# EAGLE design lmx2572_single_ended (EAGLE 9.5.2)
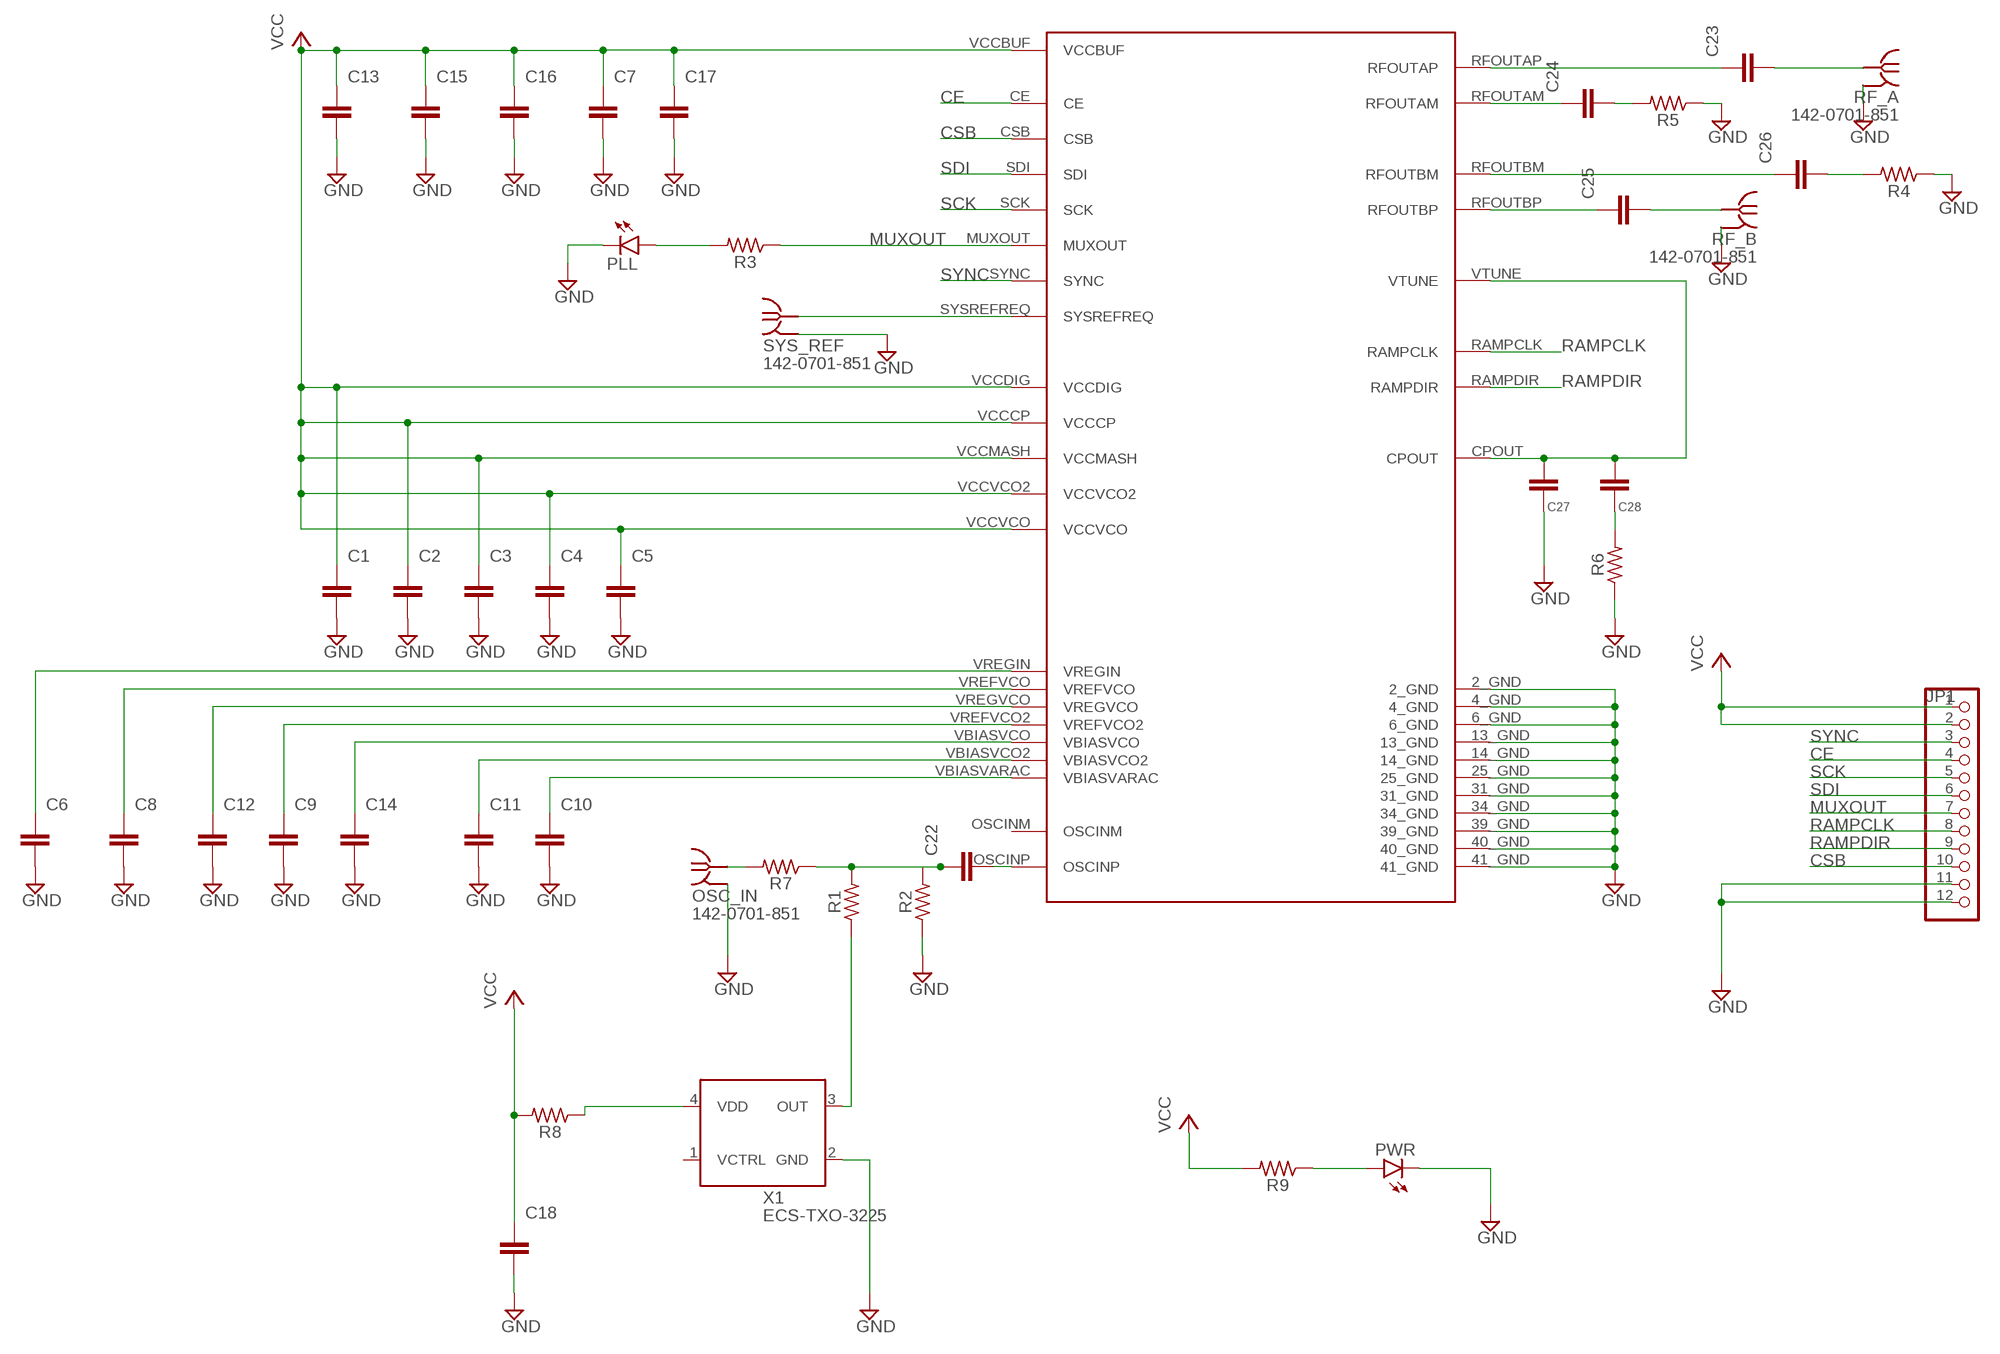
[diagram p0: schematic, sheet 1]

## Parts
C1  1.0uF  C-EU0603-B-NOSILK  [.0603-B-NOSILK]
C2  1.0uF  C-EU0603-B-NOSILK  [.0603-B-NOSILK]
C3  1.0uF  C-EU0603-B-NOSILK  [.0603-B-NOSILK]
C4  1.0uF  C-EU0603-B-NOSILK  [.0603-B-NOSILK]
C5  1.0uF  C-EU0603-B-NOSILK  [.0603-B-NOSILK]
C6  1.0uF  C-EU0603-B-NOSILK  [.0603-B-NOSILK]
C7  0.1uF  C-EU0603-B-NOSILK  [.0603-B-NOSILK]
C8  10uF  C-EU0603-B-NOSILK  [.0603-B-NOSILK]
C9  10uF  C-EU0603-B-NOSILK  [.0603-B-NOSILK]
C10  10uF  C-EU0603-B-NOSILK  [.0603-B-NOSILK]
C11  0.1uF  C-EU0603-B-NOSILK  [.0603-B-NOSILK]
C12  10nF  C-EU0603-B-NOSILK  [.0603-B-NOSILK]
C13  0.1uF  C-EU0603-B-NOSILK  [.0603-B-NOSILK]
C14  470pF  C-EU0603-B-NOSILK  [.0603-B-NOSILK]
C15  10uF  C-EU0603-B-NOSILK  [.0603-B-NOSILK]
C16  10uF  C-EU0603-B-NOSILK  [.0603-B-NOSILK]
C17  0.1uF  C-EU0603-B-NOSILK  [.0603-B-NOSILK]
C18  10uF  C-EU0603-B-NOSILK  [.0603-B-NOSILK]
C22  0.1uF  C-EU0402-C-NOSILK  [.0402-C-NOSILK]
C23  100PF  C-EU0402-C-NOSILK  [.0402-C-NOSILK]
C24  100PF  C-EU0402-C-NOSILK  [.0402-C-NOSILK]
C25  100PF  C-EU0402-C-NOSILK  [.0402-C-NOSILK]
C26  100PF  C-EU0402-C-NOSILK  [.0402-C-NOSILK]
C27  4.7nf  C-EU0402-C-NOSILK  [.0402-C-NOSILK]
C28  220nf  C-EU0402-C-NOSILK  [.0402-C-NOSILK]
JP1  PINHD-1X12  [1X12]
OSC_IN  142-0701-851  [142-0701-851]
PLL  LEDCHIP-LED0603  [CHIP-LED0603]
PWR  LEDCHIP-LED0603  [CHIP-LED0603]
R1  0  R-US_0402-C-NOSILK  [.0402-C-NOSILK]
R2  50  R-US_0402-C-NOSILK  [.0402-C-NOSILK]
R3  330  R-US_0603-B-NOSILK  [.0603-B-NOSILK]
R4  50  R-US_0402-C-NOSILK  [.0402-C-NOSILK]
R5  50  R-US_0402-C-NOSILK  [.0402-C-NOSILK]
R6  100  R-US_0402-C-NOSILK  [.0402-C-NOSILK]
R7  0  R-US_0402-C-NOSILK  [.0402-C-NOSILK]
R8  0  R-US_0402-C-NOSILK  [.0402-C-NOSILK]
R9  330  R-US_0603-B-NOSILK  [.0603-B-NOSILK]
RF_A  142-0701-851  [142-0701-851]
RF_B  142-0701-851  [142-0701-851]
SYS_REF  142-0701-851  [142-0701-851]
U$1  LMX2572_QFN  [LMX2572_QFN]
X1  ECS-TXO-3225  [3.2X2.5]

## Nets
CE: JP1.4 U$1.CE
CSB: JP1.10 U$1.CSB
GND: C1.2 C2.2 C3.2 C4.2 C5.2 C6.2 C7.2 C8.2 C9.2 C10.2 C11.2 C12.2 C13.2 C14.2 C15.2 C16.2 C17.2 C18.2 C27.1 JP1.11 JP1.12 OSC_IN.GND1(GND) OSC_IN.GND2(GND) OSC_IN.GND3(GND) OSC_IN.GND4(GND) PLL.C PWR.C R2.1 R4.1 R5.1 R6.1 RF_A.GND1(GND) RF_A.GND2(GND) RF_A.GND3(GND) RF_A.GND4(GND) RF_B.GND1(GND) RF_B.GND2(GND) RF_B.GND3(GND) RF_B.GND4(GND) SYS_REF.GND1(GND) SYS_REF.GND2(GND) SYS_REF.GND3(GND) SYS_REF.GND4(GND) U$1.2_GND U$1.4_GND U$1.6_GND U$1.13_GND U$1.14_GND U$1.25_GND U$1.31_GND U$1.34_GND U$1.39_GND U$1.40_GND U$1.41_GND X1.2(GND)
MUXOUT: JP1.7 R3.1 U$1.MUXOUT
N$1: C10.1 U$1.VBIASVARAC
N$2: C11.1 U$1.VBIASVCO2
N$3: C14.1 U$1.VBIASVCO
N$4: C9.1 U$1.VREFVCO2
N$5: C12.1 U$1.VREGVCO
N$6: C8.1 U$1.VREFVCO
N$7: C6.1 U$1.VREGIN
N$8: C22.2 U$1.OSCINP
N$9 [RF]: R1.1 X1.3(OUT)
N$10: R8.1 X1.4(VDD)
N$11 [RF]: OSC_IN.RF1(RF) R7.2
N$12: C28.1 R6.2
N$13 [RF]: SYS_REF.RF1(RF) U$1.SYSREFREQ
N$14: PLL.A R3.2
N$15: C26.1 U$1.RFOUTBM
N$16 [RF]: C23.1 U$1.RFOUTAP
N$17 [RF]: C23.2 RF_A.RF1(RF)
N$18 [RF]: C25.2 RF_B.RF1(RF)
N$19 [RF]: C25.1 U$1.RFOUTBP
N$20 [RF]: C24.1 U$1.RFOUTAM
N$21 [RF]: C22.1 R1.2 R2.2 R7.1
N$22 [RF]: C26.2 R4.2
N$23 [RF]: C24.2 R5.2
N$24: C27.2 C28.2 U$1.CPOUT U$1.VTUNE
N$25: PWR.A R9.1
RAMPCLK: JP1.8 U$1.RAMPCLK
RAMPDIR: JP1.9 U$1.RAMPDIR
SCK: JP1.5 U$1.SCK
SDI: JP1.6 U$1.SDI
SYNC: JP1.3 U$1.SYNC
VCC [Power]: C1.1 C2.1 C3.1 C4.1 C5.1 C7.1 C13.1 C15.1 C16.1 C17.1 C18.1 JP1.1 JP1.2 R8.2 R9.2 U$1.VCCBUF U$1.VCCCP U$1.VCCDIG U$1.VCCMASH U$1.VCCVCO U$1.VCCVCO2
Unconnected: U$1.OSCINM X1.1(VCTRL)

## Library data of the parts
C1-C18 C22-C28 = oresat-rcl:C-EU: CAPACITOR, European symbol
JP1 = pinhead:PINHD-1X12: PIN HEADER
OSC_IN RF_A RF_B SYS_REF = J-Cinch-142-0701-851-SMA-end-launch:142-0701-851: SMA Jack 50Ω - End Launch Source: Datasheet <https://belfuse.com/resources/productinformations/cinchconnectivitysolutions/johnson/pi-ccs-john-142-0701-851.pdf>
PLL PWR = led:LED: LED OSRAM: - CHIPLED LG R971, LG N971, LY N971, LG Q971, LY Q971, LO R971, LY R971 LH N974, LH R974 LS Q976, LO Q976, LY Q976 LO Q996 - Hyper CHIPLED LW Q18S LB Q993, LB Q99A, LB R99A - SideLED LS A670, LO A670, LY A670, LG A670, LP A670 LB A673, LV A673, LT A673, LW A673 LH A674 LY A675 LS A676, LA A676, LO A676, LY A676, LW A676 LS A679, LY A679, LG A679 - Hyper Micro SIDELED® LS Y876, LA Y876, LO Y876, LY Y876 LT Y87S - SmartLED LW L88C, LW L88S LB L89C, LB L89S, LG L890 LS L89K, LO L89K, LY L89K LS L896, LA L896, LO L896, LY L896 - TOPLED LS T670, LO T670, LY T670, LG T670, LP T670 LSG T670, LSP T670, LSY T670, LOP T670, LYG T670 LG T671, LOG T671, LSG T671 LB T673, LV T673, LT T673, LW T673 LH T674 LS T676, LA T676, LO T676, LY T676, LB T676, LH T676, LSB T676, LW T676 LB T67C, LV T67C, LT T67C, LS T67K, LO T67K, LY T67K, LW E67C LS E67B, LA E67B, LO E67B, LY E67B, LB E67C, LV E67C, LT E67C LW T67C LS T679, LY T679, LG T679 LS T770, LO T770, LY T770, LG T770, LP T770 LB T773, LV T773, LT T773, LW T773 LH T774 LS E675, LA E675, LY E675, LS T675 LS T776, LA T776, LO T776, LY T776, LB T776 LHGB T686 LT T68C, LB T68C - Hyper Mini TOPLED® LB M676 - Mini TOPLED Santana® LG M470 LS M47K, LO M47K, LY M47K Source: http://www.osram.convergy.de LUXEON: - LUMILED® LXK2-PW12-R00, LXK2-PW12-S00, LXK2-PW14-U00, LXK2-PW14-V00 LXK2-PM12-R00, LXK2-PM12-S00, LXK2-PM14-U00 LXK2-PE12-Q00, LXK2-PE12-R00, LXK2-PE12-S00, LXK2-PE14-T00, LXK2-PE14-U00 LXK2-PB12-K00, LXK2-PB12-L00, LXK2-PB12-M00, LXK2-PB14-N00, LXK2-PB14-P00, LXK2-PB14-Q00 LXK2-PR12-L00, LXK2-PR12-M00, LXK2-PR14-Q00, LXK2-PR14-R00 LXK2-PD12-Q00, LXK2-PD12-R00, LXK2-PD12-S00 LXK2-PH12-R00, LXK2-PH12-S00 LXK2-PL12-P00, LXK2-PL12-Q00, LXK2-PL12-R00 Source: www.luxeon.com KINGBRIGHT: KA-3528ASYC Source: www.kingbright.com
R1-R9 = oresat-rcl:R-US_: RESISTOR, American symbol
U$1 = QFN50P600X600X100-41N:LMX2572_QFN
X1 = X-ECS-TXO-TCXO:ECS-TXO-3225: HCMOS TCXO Stability: 2.5ppm (-30 to +85 ℃) Source: Datasheet <https://ecsxtal.com/store/pdf/ECS-TXO-3225.pdf>

## Net classes
0 default: width 0.254 mm
2 RF: width 0.38 mm, clearance 0.6 mm

## Board
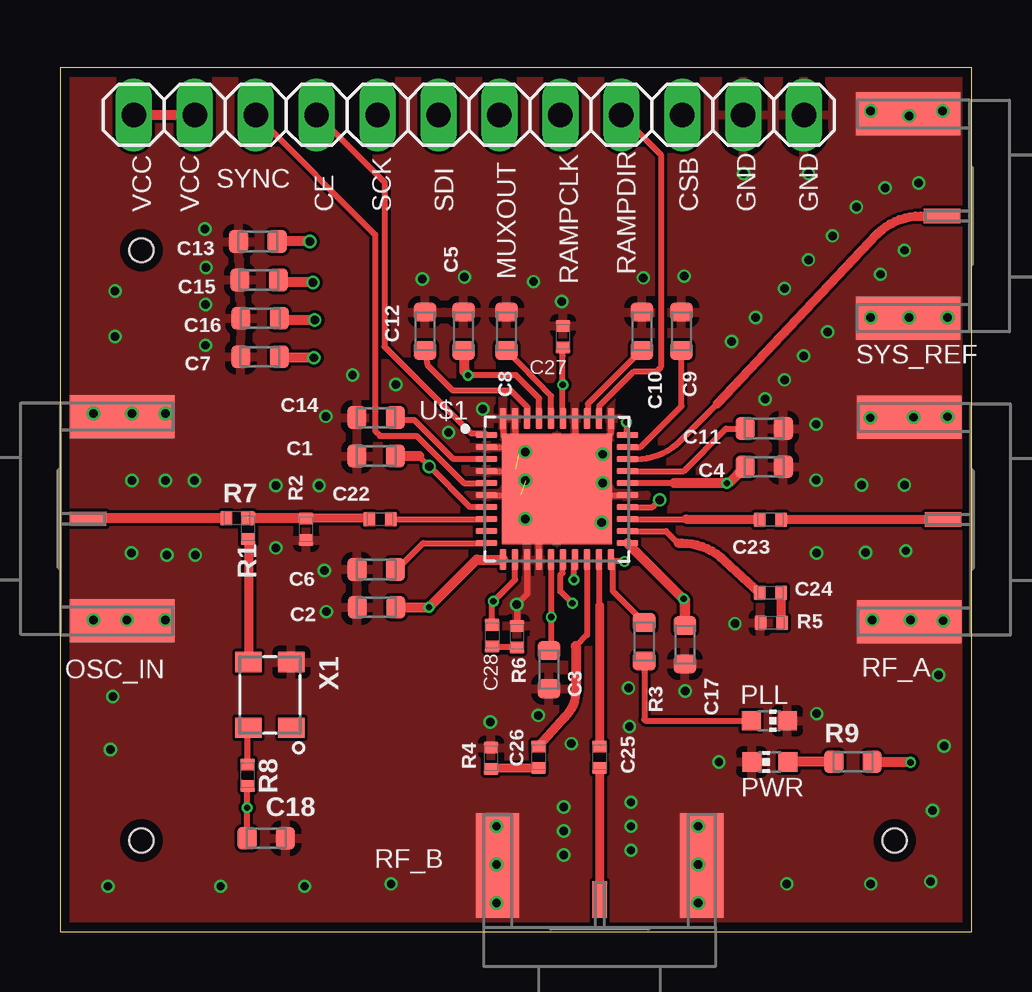
[diagram p1: board, top side]
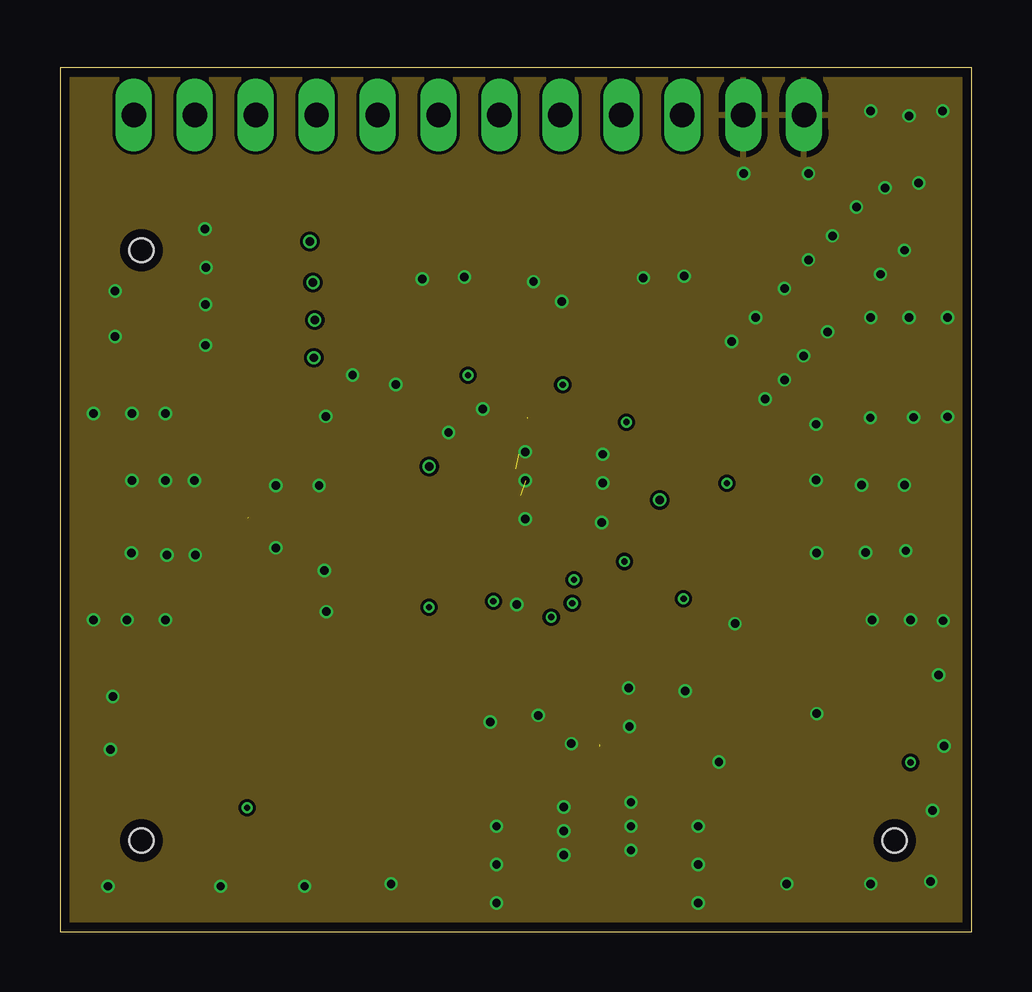
[diagram p2: board, inner layer Route2]
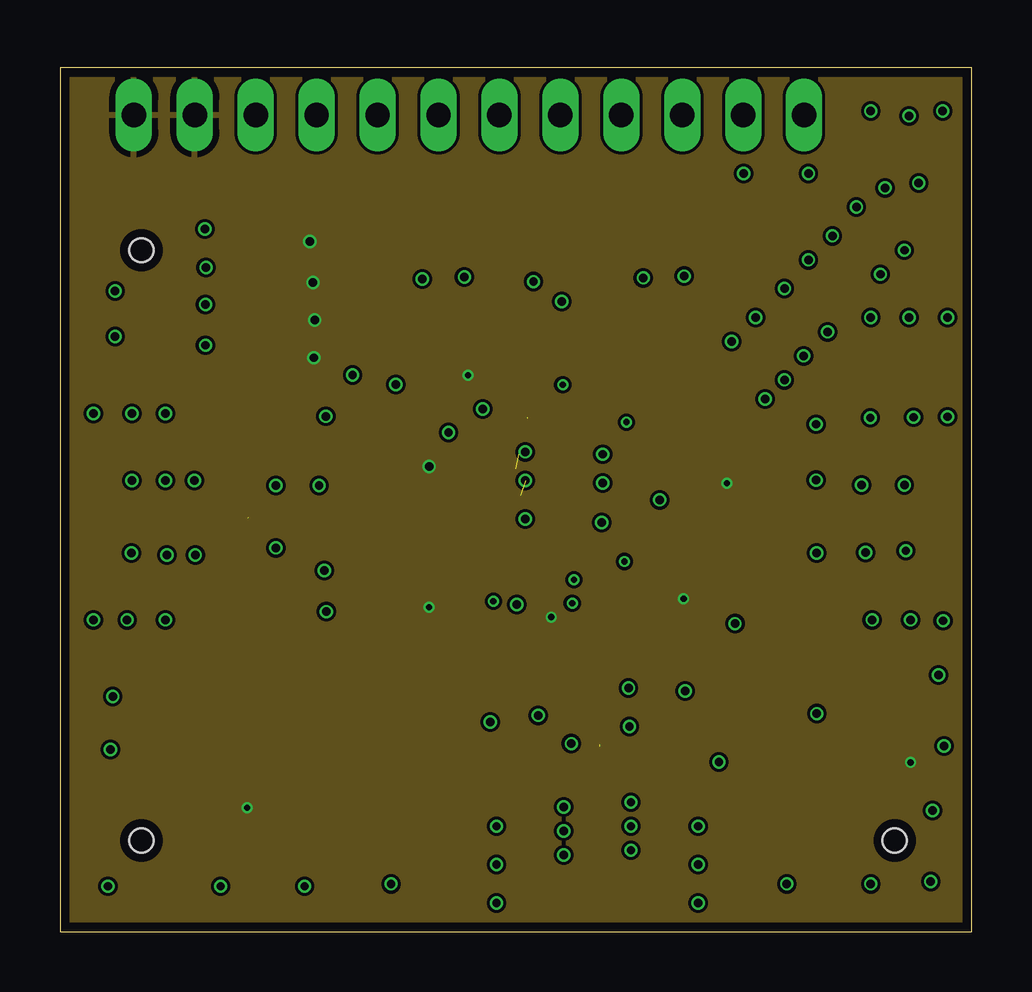
[diagram p3: board, inner layer Route15]
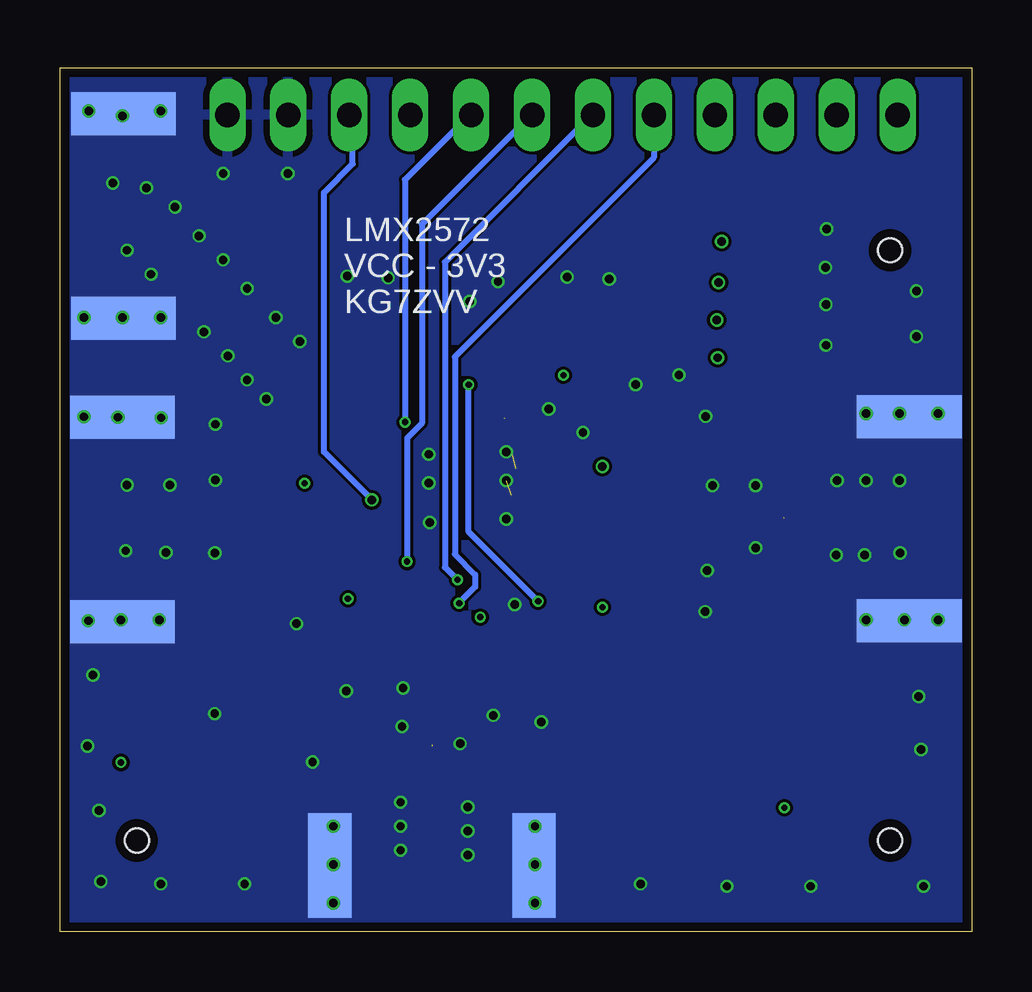
[diagram p4: board, bottom side, seen from below]

Size 38 x 36 mm. Coordinates in mm from the lower left corner, seen from the top.
Outline: 38,36 0,36 0,0 38,0 38,36
Copper layers (1*2*15*16): Top 0.035559375mm / dielectric 0.17018125mm / Route2 0.01778125mm / dielectric 47mil / Route15 0.01778125mm / dielectric 0.17018125mm / Bottom 0.035559375mm
Design rules "oshpark-4layer": minimum track width 5mil, minimum drill 10mil, track to track 5mil, track to pad 5mil, pad to pad 5mil, via to via 5mil, smd to smd 5mil, copper to edge 15mil, drill to drill 6mil, minimum pad ring 4mil, minimum via ring 4mil, stop-mask expansion 2.5mil, vias tented up to drill 0mil, thermal gap 10mil
Holes 1 mm at 3.4,28.4 3.4,3.8 34.8,3.8

### Footprints (pad centres in the part's own frame; a part is rotated, then mirrored left to right if it is on the bottom)
.0603-B-NOSILK = smd 0.8 x 0.95: 1 -0.8,0; 2 0.8,0
.0402-C-NOSILK = smd 0.5 x 0.6: 1 -0.45,0; 2 0.45,0
1X12 = drill 1.016 long: 1 -13.97,0; 2 -11.43,0; 3 -8.89,0; 4 -6.35,0; 5 -3.81,0; 6 -1.27,0; 7 1.27,0; 8 3.81,0; 9 6.35,0; 10 8.89,0; 11 11.43,0; 12 13.97,0
142-0701-851 = smd 1.8 x 4.37: GND1 -4.255,-2.566; GND2 4.255,-2.566 | smd 1.8 x 4.37 bottom: GND3 -4.255,-2.566; GND4 4.255,-2.566 | smd 0.6 x 1.53: RF1 0,-1.146
CHIP-LED0603 = smd 0.8 x 0.8: A 0,-0.75; C 0,0.75
LMX2572_QFN = smd 0.89 x 0.26: 2_GND -2.94,1.75; 4_GND -2.94,0.75; 6_GND -2.94,-0.25; 25_GND 2.94,-0.25; CE -2.94,2.25; CSB 2.94,-0.75; OSCINM -2.94,-1.75; OSCINP -2.94,-1.25; RAMPCLK 2.94,2.25; RFOUTAM 2.94,-1.75; RFOUTAP 2.94,-1.25; SYNC -2.94,0.25; SYSREFREQ 2.94,1.25; VBIASVCO -2.94,1.25; VBIASVCO2 2.94,0.75; VCCBUF 2.94,-2.25; VCCDIG -2.94,-0.75; VCCVCO2 2.94,0.25; VREFVCO2 2.94,1.75; VREGIN -2.94,-2.25 | smd 0.26 x 0.89: 13_GND -1.25,-2.94; 14_GND -0.75,-2.94; 31_GND 2.25,2.94; 34_GND 0.75,2.94; 39_GND -1.75,2.94; 40_GND -2.25,2.94; CPOUT -1.75,-2.94; MUXOUT 2.25,-2.94; RAMPDIR 1.75,2.94; RFOUTBM 1.25,-2.94; RFOUTBP 1.75,-2.94; SCK 0.25,-2.94; SDI 0.75,-2.94; VBIASVARAC 1.25,2.94; VCCCP -2.25,-2.94; VCCMASH -0.25,-2.94; VCCVCO -0.75,2.94; VREFVCO -0.25,2.94; VREGVCO -1.25,2.94; VTUNE 0.25,2.94 | smd 4.59 x 4.59: 41_GND 0,0
3.2X2.5 = smd 0.85 x 1.09: 1 -1.365,-0.895; 2 1.365,-0.895; 3 1.365,0.895; 4 -1.365,0.895

### Placement (x,y rotation side)
C1  13.18,19.83 180 top
C2  13.19,13.53 180 top
C3  20.39,10.93 270 top
C4  29.36,19.37 0 top
C5  16.82,25.03 90 top
C6  13.19,15.1 180 top
C7  8.34,23.96 180 top
C8  18.61,25.03 90 top
C9  25.91,25.03 90 top
C10  24.26,25.03 90 top
C11  29.36,20.97 0 top
C12  15.22,25.03 90 top
C13  8.25,28.76 180 top
C14  13.18,21.43 180 top
C15  8.3,27.16 180 top
C16  8.35,25.56 180 top
C17  26.06,11.96 270 top
C18  8.6,3.9 0 top
C22  13.34,17.19 0 top
C23  29.61,17.18 0 top
C24  29.61,14.13 0 top
C25  22.5,7.27 270 top
C26  19.96,7.27 270 top
C27  20.97,24.8 270 top
C28  18.02,12.35 90 top
JP1  17.05,34.04 0 top
OSC_IN  0.02,17.21 90 top
PLL  29.57,8.8 270 top
PWR  29.59,7.08 90 top
R1  7.84,16.82 90 top
R2  10.26,16.78 90 top
R3  24.36,12.09 270 top
R4  17.97,7.23 270 top
R5  29.66,12.88 0 top
R6  19.05,12.3 270 top
R7  7.38,17.24 180 top
R8  7.82,6.52 270 top
R9  33.06,7.09 0 top
RF_A  37.96,17.18 270 top
RF_B  22.5,0.2 180 top
SYS_REF  37.92,29.83 270 top
U$1  20.72,18.45 0 top
X1  8.75,9.87 90 top

### Tracks (layer width: path | path; a pad name or v marks a point on that pad's centre or on a via)
CE
  Top 0.254: U$1.CE 17.72,20.77 17.14,20.77 13.53,24.38 13.53,31.24 10.76,34 JP1.4
CSB  (via drill 0.35)
  Top 0.254: U$1.CSB 24.7,17.7 v25,18
  Bottom 0.254: v25,18 27,20 27,30.8 25.8,32 25.8,33.9 JP1.10
GND  (via drill 0.35)  (2 unrouted)
  Top 0.254: 18.97,20.18 18.84,20.3 18.48,20.67 18.48,20.92 18.47,20.93 U$1.40_GND | U$1.25_GND 23.62,18.19 20.95,18.19 20.77,18.38 U$1.41_GND | 19.14,19.91 U$1.41_GND | 18.95,21.43 U$1.39_GND | 18.95,21.43 U$1.39_GND | U$1.40_GND 18.48,21.43 U$1.40_GND | 20.95,18.29 U$1.41_GND | U$1.41_GND 19.97,17.7 | 19.97,17.7 19.73,17.46 19.73,16.67 | U$1.6_GND 19.2,18.2 | U$1.4_GND 18.9,19.2 19,19.3 | U$1.2_GND 18.74,20.2 | U$1.39_GND 18.97,20.18 | U$1.40_GND 18.51,21.43 18.95,21.43 | U$1.14_GND 19.97,17.7 | 19.47,16.52 19.58,16.52 | U$1.34_GND 21.47,20 22.2,20 22.96,20.76 22.96,20.92 22.97,20.93 U$1.31_GND | U$1.41_GND 20.7,18.45 18.97,20.18 | U$1.41_GND 19.75,18.45 v19.4,18.8 | U$1.41_GND 19.4,19.77 v19.4,20 | U$1.13_GND 19.47,14.07 v19.05,13.65 R6.1
  Top 0.406: 19.73,16.67 19.58,16.52 19.47,16.41 | 18.74,20.2 18.84,20.3
  Bottom 0.254: 18.29,2.76 RF_B.GND4 | 35.47,12.94 RF_A.GND4 35.38,12.85 | 35.47,21.42 RF_A.GND3 35.47,21.52 | 35.43,25.53 SYS_REF.GND4 35.43,25.62 | 26.77,4.48 26.77,2.86 RF_B.GND3 | 35.34,34.1 SYS_REF.GND3 35.43,34 | 31.05,34.1 JP1.12
  other vias: 31.52,18.82 33.42,18.62 35.2,18.62 33.78,21.42 35.58,21.44 37,21.46 35.26,15.88 33.58,15.8 31.54,15.78 33.86,13 35.46,13 36.82,12.96 37,25.6 35.4,25.6 33.8,25.6 36.8,34.2 35.4,34 33.8,34.2 35.8,31.2 34.4,31 33.2,30.2 32.2,29 31.2,28 30.2,26.8 35.2,28.4 34.2,27.4 32,25 31,24 29,25.6 30.2,23 28,24.6 29.4,22.2 23.7,10.16 31.55,9.09 23.8,5.4 23.8,4.4 23.8,3.4 21,5.2 21,4.2 21,3.2 26.6,4.4 26.6,1.2 18.2,1.2 18.2,4.4 21.32,7.84 16.2,20.8 14,22.8 12.2,23.2 11.08,21.48 10.8,18.6 11.02,15.06 9,18.6 9,16 5.6,18.8 4.4,18.8 3,18.8 4.46,15.7 5.64,15.7 1.4,21.6 3,21.6 4.4,21.6 1.4,13 2.8,13 4.4,13 18.2,2.8 26.6,2.8 19.4,17.2 28.5,31.6 31.2,31.6 2.3,26.7 2.3,24.8 2.2,9.8 2.1,7.6 2,1.9 6.7,1.9 10.2,1.9 13.8,2 30.3,2 33.8,2 36.3,2.1 36.38,5.06 36.62,10.7 2.98,15.78 11.1,13.34 17.94,8.74 19.94,9.02 26.06,10.04 28.14,12.84 23.74,8.56 22.62,19.9 22.62,18.7 22.58,17.06 15.1,27.2 16.86,27.28 26.02,27.32 24.32,27.25 20.92,26.26 31.52,21.15 6.04,29.29 6.09,27.68 6.07,26.14 6.07,24.44 27.47,7.08 36.85,7.74 19.74,27.09 17.63,21.79
  pour Route2: 0.25,36.74 38.87,36.74 38.87,0 0.25,0
  pour Top: 0,36.6 39.62,36.6 39.62,-0.02 0,-0.02
  pour Bottom: 0.4,36.8 37.8,36.8 37.8,0.2 37.6,0 0.2,0 0.2,36.6
  pour Top (no thermals): 32.5,36 39.4,36 39.4,9 32.5,9
  pour Top (no thermals): -1.3,24 6.1,24 6.1,10.4 -1.3,10.4
  pour Top (no thermals): 16.52,5.7 16.52,-1.3 28.96,-1.3 28.96,5.7
  pour Bottom (no thermals): 32.6,37.32 41,37.32 41,9.98 32.6,9.98
  pour Bottom (no thermals): 15.5,5.3 29.6,5.3 29.6,-2.2 15.5,-2.2
  pour Bottom (no thermals): -2.2,23.2 5.6,23.2 5.6,11.2 -2.2,11.2
MUXOUT  (via drill 0.25)
  Top 0.254: 23.05,15.43 23.05,14.19 24.29,12.95 R3.1 | 23.05,15.43 U$1.MUXOUT | v23.53,15.43 23.05,15.43
  Bottom 0.254: v23.53,15.43 23.53,20.57 22.91,21.19 22.91,29.48 18.38,34 JP1.7
N$1
  Top 0.254: U$1.VBIASVARAC 22,21.43 22,22 24.19,24.19 C10.1
N$2
  Top 0.254: U$1.VBIASVCO2 26,19.2 27.77,20.97 C11.1
N$3
  Top 0.254: U$1.VBIASVCO 17.72,19.72 16.38,19.72 14.76,21.34 14.1,21.34 C14.1
N$4
  Top 0.254: U$1.VREFVCO2 24.2,20.2 25.91,21.91 C9.1
N$5  (1 unrouted)
  Top 0.254: 19.49,21.41 19.49,21.85 18.77,22.57 16.37,22.57 15.34,23.59 C12.1
N$6
  Top 0.254: U$1.VREFVCO 20.47,22.32 C8.1
N$7
  Top 0.254: U$1.VREGIN 17.72,16.19 15.14,16.19 14.1,15.14 C6.1
N$8
  Top 0.254: C22.2 U$1.OSCINP
N$9
  Top 0.38: R1.1 7.86,16.36 X1.3
N$10
  Top 0.254: R8.1 7.82,8.47 X1.4
N$11
  Top 0.406: R7.2 1.19,17.24 OSC_IN.RF1
N$12
  Top 0.254: R6.2 18.06,11.85 C28.1
N$13
  Top 0.254: U$1.SYSREFREQ 24.05,19.7 arc45 25.84,20.44 27.4,22
  Top 0.38: SYS_REF.RF1 35.88,29.83 arc45 34.08,29.08 27.4,22
N$14
  Top 0.254: R3.2 24.36,8.84 24.4,8.8 PLL.A
N$15
  Top 0.254: U$1.RFOUTBM 21.97,12.37 21.5,11.9
  Top 0.38: 21.5,10.02 arc-45 21.06,8.95 C26.1
  Top 0.406: 21.5,11.9 21.5,10.02
N$16
  Top 0.254: U$1.RFOUTAP 26.1,17.2
  Top 0.38: 26.1,17.2 29.16,17.2 C23.1
N$17
  Top 0.38: RF_A.RF1 C23.2
N$18
  Top 0.38: C25.2 RF_B.RF1
N$19  (1 unrouted)
  Top 0.254: U$1.RFOUTBP 22.47,13.61 22.5,13.58
  Top 0.38: 22.5,13.58 22.5,7.8
N$20
  Top 0.254: U$1.RFOUTAM 25.27,16.7 25.77,16.2
  Top 0.38: C24.1 27.71,15.46 arc45 25.91,16.2 25.77,16.2
N$21  (1 unrouted)
  Top 0.38: 12.86,17.23 R2.2
  Top 0.406: C22.1 12.86,17.23 | R2.2 7.88,17.23 R1.2
N$22
  Top 0.38: C26.2 18.02,6.82 R4.2
N$23
  Top 0.38: C24.2 30.06,12.93 R5.2
N$24  (via drill 0.25)
  Top 0.254: v20.95,22.79 20.95,21.43 U$1.VTUNE | v20.95,22.79 20.95,24 C27.2 | v20.96,22.79 v20.95,22.79 | C28.2 18.02,13.72 v18.06,13.77 18.97,14.67 U$1.CPOUT
  Bottom 0.254: v20.96,22.79 20.96,16.66 v18.06,13.77
N$25
  Top 0.406: R9.1 PWR.A
RAMPCLK  (via drill 0.25)
  Top 0.254: v23.62,21.24 23.62,20.77 U$1.RAMPCLK
  Bottom 0.254: v23.62,21.24 23.62,31.34 20.95,34 JP1.8
RAMPDIR
  Top 0.254: U$1.RAMPDIR 22.48,21.43 22.48,21.91 23.91,23.34 24.86,23.34 25.05,23.53 25.05,32.38 23.43,34 JP1.9
SCK  (via drill 0.25)
  Top 0.254: v21.36,13.69 20.86,14.18 20.86,14.86 20.95,14.95 20.95,15.43 U$1.SCK
  Bottom 0.254: JP1.5 13.24,32.26 21.54,23.96 21.54,15.74 20.69,14.89 20.69,14.37 21.36,13.7 v21.36,13.69
SDI  (via drill 0.25)
  Top 0.254: v21.43,14.67 21.43,15.43 U$1.SDI
  Bottom 0.254: v21.43,14.67 21.95,15.19 21.95,27.9 15.82,34.04 JP1.6
SYNC
  Top 0.254: JP1.3 8.19,34 13.14,29.05 13.14,20.86 13.34,20.67 14.86,20.67 16.83,18.69 U$1.SYNC
VCC  (via drill 0.25, 0.35)
  Top 0.254: U$1.VCCDIG 17.1,17.7 v15.4,19.4 14.97,19.83 | U$1.VCCMASH v20.47,13.12 20.47,11.86 | 25.59,18.7 U$1.VCCVCO2 | U$1.VCCVCO 19.97,22.23 19.01,23.19 v17,23.19 | C18.1 v7.8,5.17 v7.8,5.18 7.8,6.05 R8.2 | 33.89,7.06 R9.2
  Top 0.406: U$1.VCCBUF 26.06,13.8 C17.1 26.06,13.82 v26,13.88 | 14.97,19.83 C1.1 13.91,19.72 | 20.47,11.86 C3.1 20.29,11.62 | 14.1,13.62 C2.1 15.37,13.53 v15.38,13.52 17.37,15.51 U$1.VCCCP | C5.1 16.86,24.1 16.86,23.34 v17,23.19 | 28.48,19.34 C4.1 27.88,18.7 v27.8,18.7 25.6,18.7 25.59,18.7 | 9.24,24 C7.1 9.34,23.81 9.44,23.92 v10.59,23.92 | 9.14,27.24 C15.1 9.24,27.05 9.25,27.06 v10.55,27.06 | 9.14,28.67 C13.1 9.05,28.96 9.24,28.77 v10.42,28.77 | 9.24,25.72 C16.1 9.24,25.53 9.28,25.49 v10.62,25.49 | JP1.2 5.71,34 5.68,34.04 JP1.1 | v20.48,13.12 v20.47,13.12 | v15.4,19.4 v15.39,19.39 | v35.46,7.06 33.89,7.06
  pour Route15: 0.22,36.78 37.96,36.78 37.96,0.22 0.22,0.22

### Text on the board
tNames: SYNC | VCC | VCC | CE | SCK | SDI | CSB | GND | GND | MUXOUT | RAMPCLK | RAMPDIR
bNames: LMX2572 / VCC - 3V3 / KG7ZVV